# Altium schematic sheet v1.0.SchDoc
size 114 x 101 mm
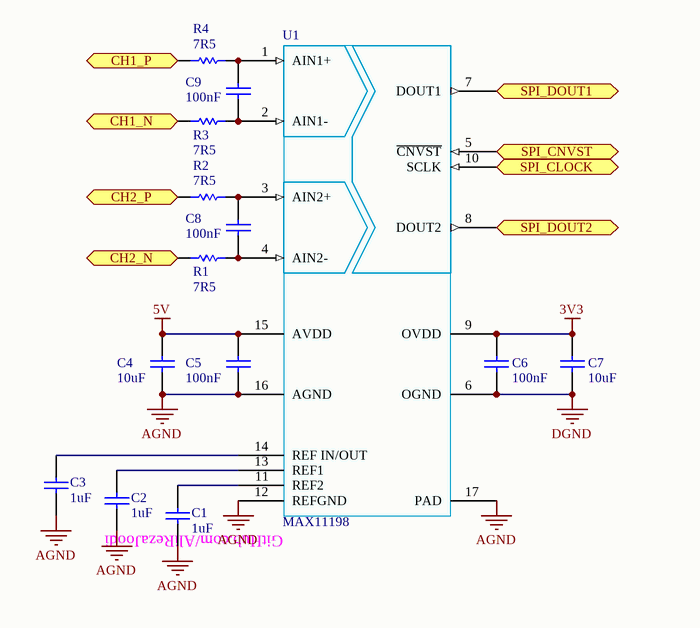
[diagram p0: v1.0.SchDoc]

## Parts
C1  1uF  [SMD_0805]
C2  1uF  [SMD_0805]
C3  1uF  [SMD_0805]
C4  10uF  [SMD_0805]
C5  100nF  [SMD_0805]
C6  100nF  [SMD_0805]
C7  10uF  [SMD_0805]
C8  100nF  [SMD_0805]
C9  100nF  [SMD_0805]
R1  7R5  [SMD_0805]
R2  7R5  [SMD_0805]
R3  7R5  [SMD_0805]
R4  7R5  [SMD_0805]
U1  MAX11198  [16TDFN]

## Ports
CH1_N (in), CH1_P (in), CH2_N (in), CH2_P (in), SPI_CLOCK (in), SPI_CNVST (in), SPI_DOUT1 (out), SPI_DOUT2 (out)

## Nets
3V3: C6.2 C7.2 U1.9(OVDD)
5V: C4.2 C5.2 U1.15(AVDD)
AGND: C1.2 C2.2 C3.2 C4.1 C5.1 U1.12(REFGND) U1.16(AGND) U1.17(PAD)
DGND: C6.1 C7.1 U1.6(OGND)
CH1_N: R3.1 ; port CH1_N
CH1_P: R4.1 ; port CH1_P
CH2_N: R1.1 ; port CH2_N
CH2_P: R2.1 ; port CH2_P
SPI_CLOCK: U1.10(SCLK) ; port SPI_CLOCK
SPI_CNVST: U1.5(~{CNVST}) ; port SPI_CNVST
SPI_DOUT1: U1.7(DOUT1) ; port SPI_DOUT1
SPI_DOUT2: U1.8(DOUT2) ; port SPI_DOUT2
NetC1_1: C1.1 U1.11(REF2)
NetC2_1: C2.1 U1.13(REF1)
NetC3_1: C3.1 U1.14(REF_IN/OUT)
NetC8_1: C8.1 R1.2 U1.4(AIN2-)
NetC8_2: C8.2 R2.2 U1.3(AIN2+)
NetC9_1: C9.1 R3.2 U1.2(AIN1-)
NetC9_2: C9.2 R4.2 U1.1(AIN1+)

## Notes on the sheet
- (near U1) GitHub.com/AliRezaJoodi

## Library data of the parts
C1-C9 = Capacitor_Ceramic: Capacitor, Ceramic Multilayer, 25V, 10%; Revision: July-2002: Re-released for DXP Platform.
R1-R4 = Resistor: Resistor, 1/8W, 5%; Revision: July-2002: Re-released for DXP Platform.
U1 = MAX11198: IC, Dual ADCs; Manufacturer: Analog Devices / Maxim Integrated; Part Number: MAX11198ATE+T; Link: https://eu.mouser.com/ProductDetail/Analog-Devices-Maxim-Integrated/MAX11198ATE%2bT?qs=W0yvOO0ixfGwhpMFdxCrmQ%3D%3D